# EAGLE design iGeigie-special (EAGLE 5.11)
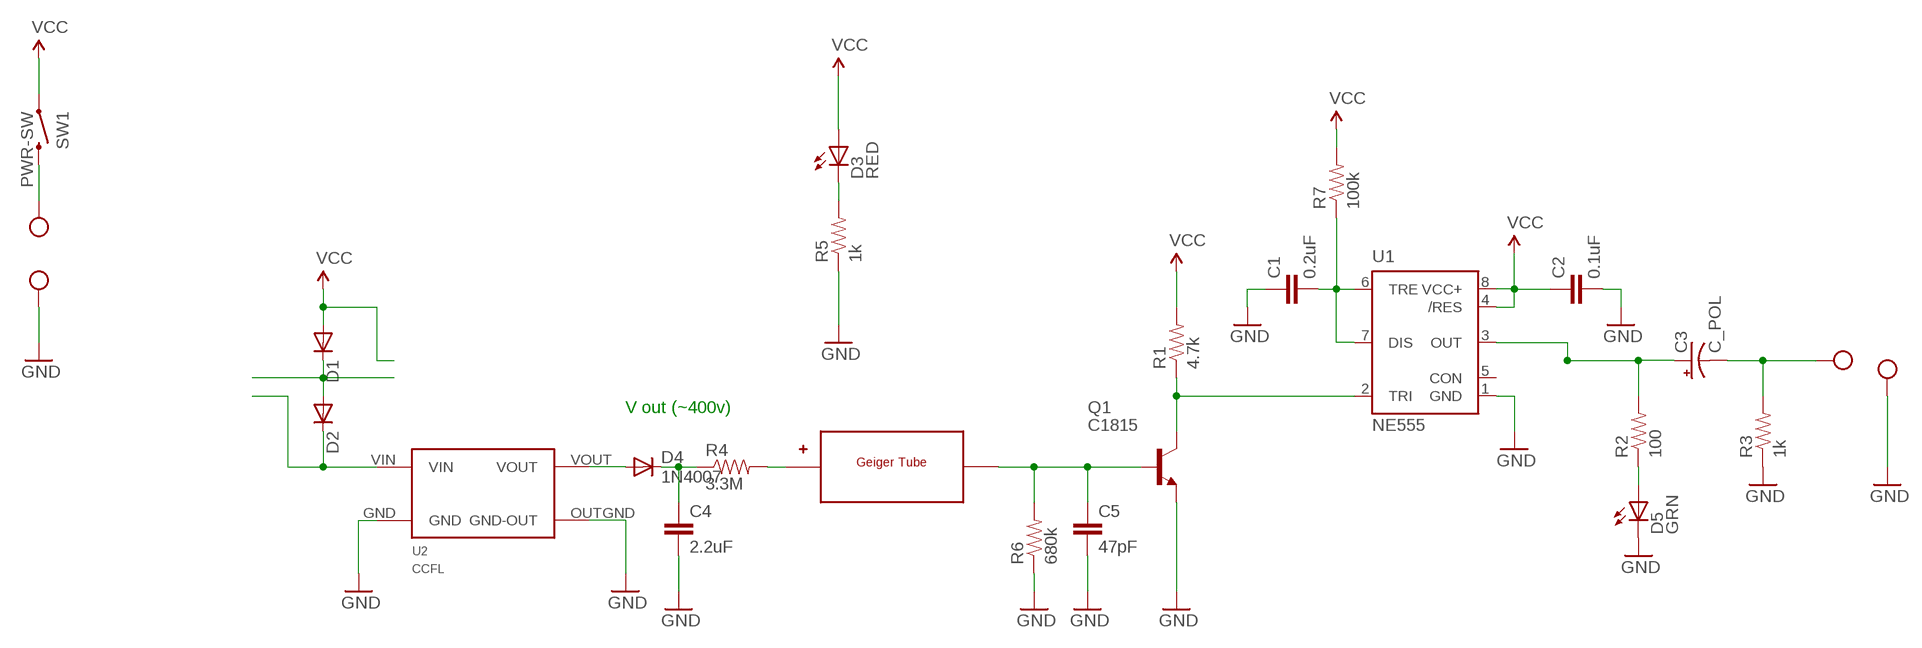
[diagram p0: schematic, sheet 1]

## Parts
C1  0.2uF  C  [C050-025X075]
C2  0.1uF  C  [C050-025X075]
C3  C_POL  [CPOL-RADIAL-100UF-25V]
C4  2.2uF  C-MICA  [C075-063X106]
C5  47pF  C  [C050-025X075]
D1  1N4004  [DO41-10]
D2  1N4004  [DO41-10]
D3  RED  LED  [LED3MM]
D4  1N4007  1N4004  [DO41-10]
D5  GRN  LED  [LED3MM]
Q1  C1815  [TO92]
R1  4.7k  R  [AXIAL-0.3]
R2  100  R  [AXIAL-0.3]
R3  1k  R  [AXIAL-0.3]
R4  3.3M  RBIG  [AXIAL-0.42]
R5  1k  R  [AXIAL-0.3]
R6  680k  R  [AXIAL-0.3]
R7  100k  R  [AXIAL-0.3]
SW1  PWR-SW  [PWR_SWITCH]
U1  NE555  [DIL-08]
U2  CCFL  [CCFL]
U$1  PIN  [PIN]
U$2  PIN  [PIN]
U$3  PIN  [PIN]
U$4  PIN  [PIN]
U$5  GEIGER  [GEIGER]

## Nets
GND: C1.1 C2.2 C4.2 C5.2 D5.K(C) Q1.3(E) R3.P$1 R5.P$1 R6.P$1 U1.1(GND) U2.GND U2.OUTGND(GND-OUT) U$2.P$1 U$3.P$1
N$1: C4.1 D4.C R4.P$1
N$2: R4.P$2 U$5.+
N$3: D3.K(C) R5.P$2
N$4: D1.C D2.A
N$5: C5.1 Q1.2(B) R6.P$2 U$5.-
N$6: Q1.1(C) R1.P$1 U1.2(TRI)
N$7: C3.+ R2.P$2 U1.3(OUT)
N$8: D5.A R2.P$1
N$9: C3.- R3.P$2 U$1.P$1
N$10: D2.C U2.VIN
N$11: D4.A U2.VOUT
N$12: SW1.2 U$4.P$1
N$13: C1.2 R7.P$1 U1.6(TRE) U1.7(DIS)
VCC: C2.1 D1.A D3.A R1.P$2 R7.P$2 SW1.1 U1.4(/RES) U1.8(VCC+)
Unconnected: U1.5(CON)

## Notes on the sheet
- V out (~400v)

## Library data of the parts
C1 C2 C5 = iGeigie:C
C3 = iGeigie:C_POL
C4 = iGeigie:C-MICA
D1 D2 D4 = iGeigie:1N4004: DIODE general purpose rectifier, 1 A
D3 D5 = iGeigie:LED
Q1 = iGeigie:C1815: NPN Transistor
R1-R7 = iGeigie:R
SW1 = iGeigie:PWR-SW
U1 = iGeigie:NE555: General purpose bipolar Timer
U2 = iGeigie:CCFL
U$1-U$4 = iGeigie:PIN
U$5 = iGeigie:GEIGER

## Board
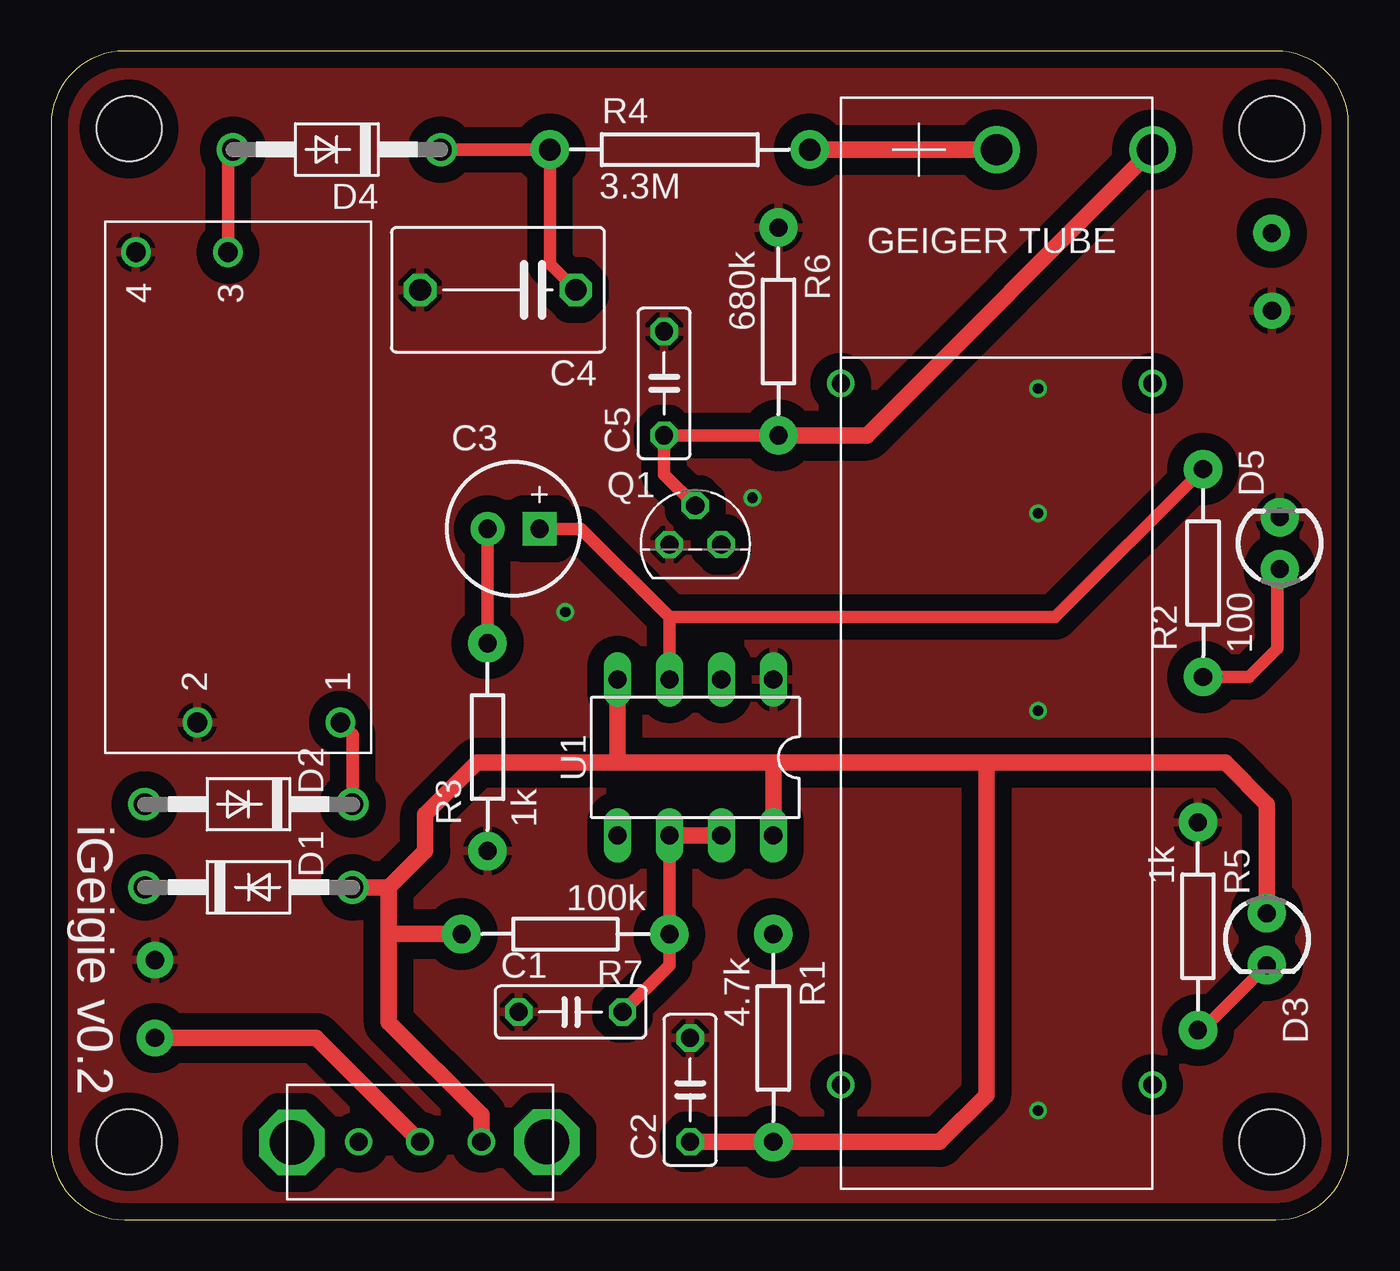
[diagram p1: board, top side]
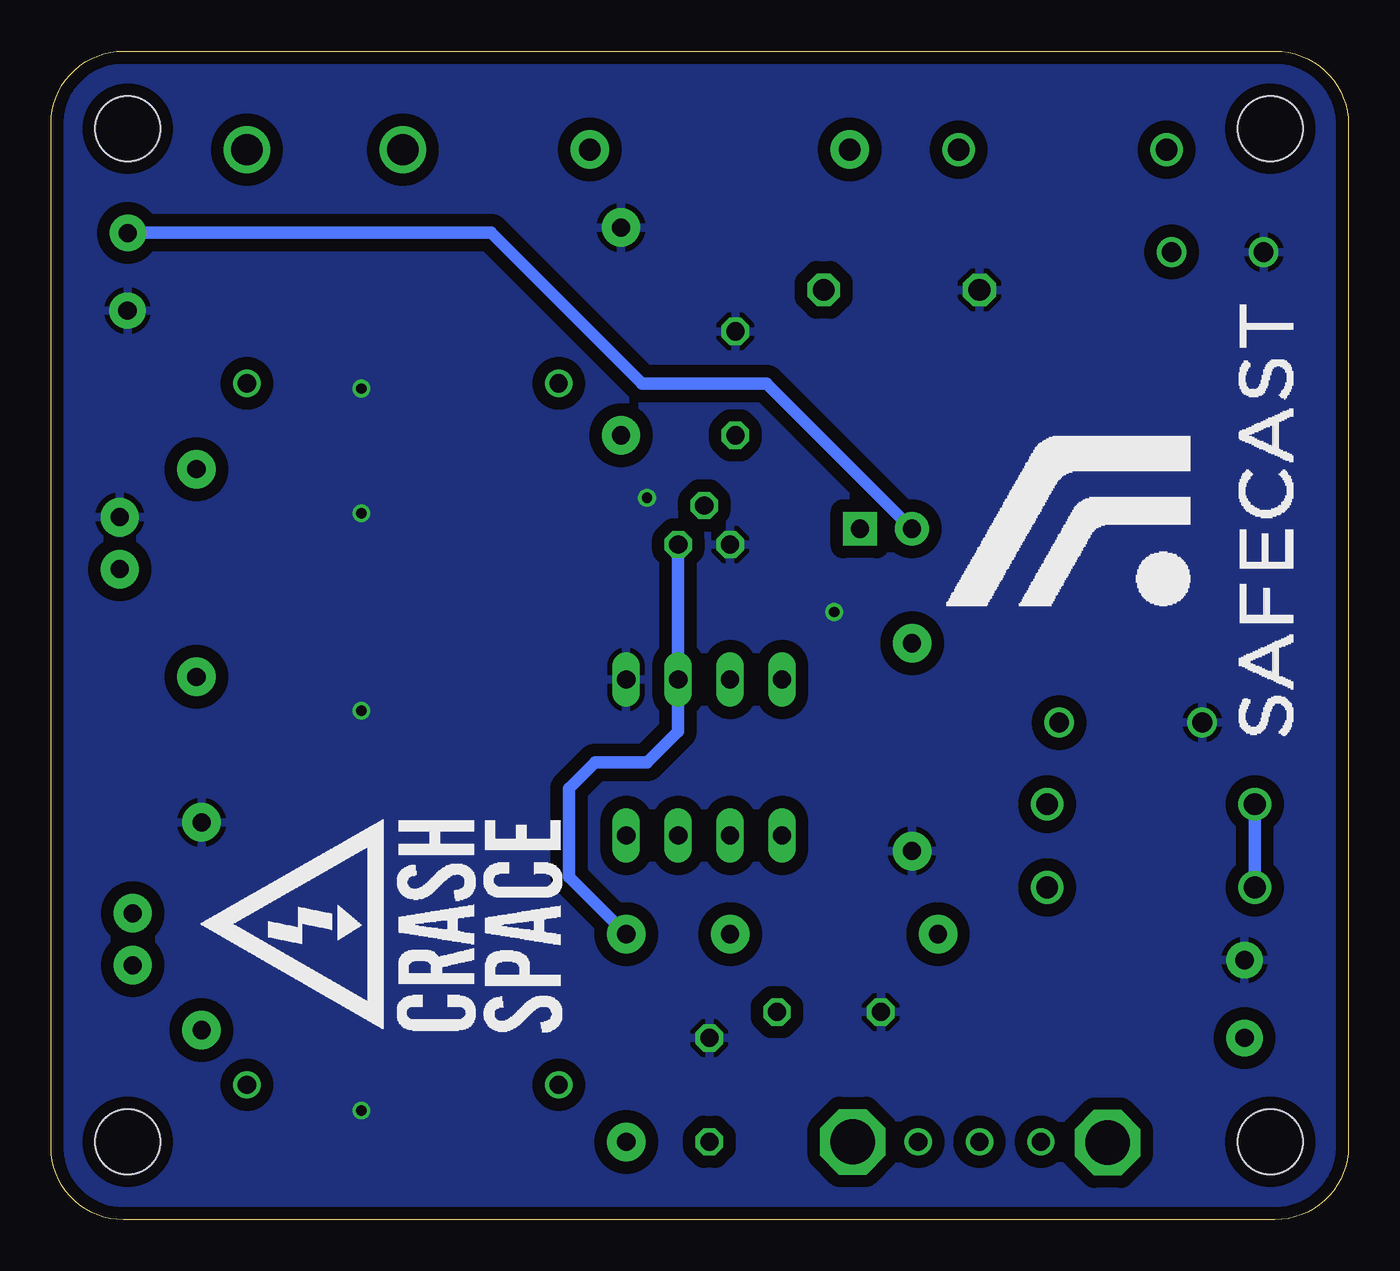
[diagram p2: board, bottom side, seen from below]

Size 63.42 x 57.14 mm. Coordinates in mm from the lower left corner, seen from the top.
Outline: 0,3.59 arc90 3.59,0 59.88,0 arc90 63.42,3.54 63.42,53.61 arc90 59.89,57.14 3.58,57.14 arc90 0,53.55 0,3.59
Copper layers (1*16): Top 0.0356mm / dielectric 1.5011mm / Bottom 0.0356mm
Design rules "LaenPCBOrder": minimum track width 6mil, minimum drill 13mil, track to track 6mil, track to pad 6mil, pad to pad 6mil, via to via 6mil, smd to smd 6mil, copper to edge 15mil, drill to drill 6mil, minimum pad ring 7mil, minimum via ring 7mil, stop-mask expansion 4mil, vias tented up to drill 0mil, thermal gap 10mil
Holes 3.17 mm at 3.81,3.81 59.69,3.81 59.69,53.34 3.81,53.34

### Footprints (pad centres in the part's own frame; a part is rotated, then mirrored left to right if it is on the bottom)
C050-025X075 = drill 0.889 octagon: 1 -2.54,0; 2 2.54,0
CPOL-RADIAL-100UF-25V = drill 0.889 pad 1.651 square: + 1.27,0 | drill 0.889 pad 1.651 round: - -1.27,0
C075-063X106 = drill 1.067 octagon: 1 -3.81,0; 2 3.81,0
DO41-10 = drill 1.067 round: A 5.08,0; C -5.08,0
LED3MM = drill 0.889 pad 1.88 round: A -1.27,0; K 1.27,0
TO92 = drill 0.889 octagon: 1 1.27,0; 2 0,1.905; 3 -1.27,0
AXIAL-0.3 = drill 0.889 pad 1.88 round: P$1 -5.08,0; P$2 5.08,0
AXIAL-0.42 = drill 1.067 pad 1.88 round: P$1 -6.35,0; P$2 6.35,0
PWR_SWITCH = drill 0.889 round: 1 -3,0; 2 0,0; 3 3,0 | drill 2.184 octagon: NC1 -6.2,0; NC2 6.26,0.04
DIL-08 = drill 0.889 long: 1 -3.81,-3.81; 2 -1.27,-3.81; 3 1.27,-3.81; 4 3.81,-3.81; 5 3.81,3.81; 6 1.27,3.81; 7 -1.27,3.81; 8 -3.81,3.81
CCFL = drill 0.965 round: GND -11.5,2; OUTGND 11.5,5; VIN -11.5,-5; VOUT 11.5,0.5
PIN = drill 0.889 pad 1.778 round: P$1 0,0
GEIGER = drill 1.524 round: + 0,0; - 7.62,0 | drill 0.889 round: P$1 -7.62,-11.43; P$2 7.62,-11.43; P$3 7.62,-45.72; P$4 -7.62,-45.72

### Placement (x,y rotation side)
C1  25.4,10.16 0 top
C2  31.24,6.35 90 top
C3  22.61,33.78 0 top
C4  21.84,45.47 180 top
C5  29.97,40.89 90 top
D1  9.65,16.26 0 top
D2  9.65,20.32 180 top
D3  59.44,13.72 270 top
D4  13.97,52.32 180 top
D5  60.07,33.08 90 top
Q1  31.5,33.02 0 top
R1  35.31,8.89 270 top
R2  56.32,31.62 90 top
R3  21.34,23.11 90 top
R4  30.73,52.32 0 top
R5  56.07,14.35 270 top
R6  35.56,43.43 270 top
R7  25.15,13.97 180 top
SW1  18.03,3.81 180 top
U1  31.5,22.61 180 top
U2  9.14,35.81 90 top
U$1  59.68,48.25 0 top
U$2  59.69,44.45 0 top
U$3  5.08,12.7 0 top
U$4  5.08,8.89 0 top
U$5  46.23,52.32 0 top

### Tracks (layer width: path | path; a pad name or v marks a point on that pad's centre or on a via)
GND  (via drill 0.51)
  other vias: 48.26,40.64 48.26,34.54 48.26,24.89 25.15,29.72 48.26,5.33 34.29,35.31
  pour Bottom (isolate 0.61): -0.51,58.17 101.6,58.17 101.6,-1.52 -0.51,-1.52
  pour Top (isolate 0.813): -1.02,0.25 -1.02,57.4 72.39,57.4 72.39,-7.62 -1.02,-7.62
N$1
  Top 0.61: D4.C R4.P$1 24.38,46.74 C4.1
N$2
  Top 0.813: R4.P$2 U$5.+
N$3
  Top 0.61: R5.P$2 56.26,9.27 D3.K
N$4
  Bottom 0.61: D1.C D2.A
N$5
  Top 0.61: R6.P$2 C5.1 29.97,36.45 Q1.2
  Top 0.813: R6.P$2 39.88,38.35 U$5.-
N$6
  Bottom 0.61: Q1.1 U1.2 32.77,23.88 34.29,22.35 36.83,22.35 38.1,21.08 38.1,16.76 R1.P$1
N$7
  Top 0.61: U1.3 30.23,29.46 | 30.23,29.46 25.91,33.78 C3.+ | 30.23,29.46 49.09,29.46 R2.P$2
N$8
  Top 0.61: R2.P$1 58.55,26.54 59.94,27.94 59.94,31.69 D5.A
N$9
  Top 0.61: R3.P$2 C3.-
  Bottom 0.61: C3.- 28.45,40.89 34.54,40.89 41.91,48.26 59.66,48.26 U$1.P$1
N$10
  Top 0.61: D2.C 14.73,23.73 U2.VIN
N$11
  Top 0.61: D4.A 8.64,52.32 U2.VOUT
N$12
  Top 0.813: U$4.P$1 12.95,8.89 SW1.2
N$13
  Top 0.61: C1.2 30.23,12.45 R7.P$1 U1.6
  Top 0.813: U1.6 U1.7
VCC
  Top 0.813: 16.51,16.26 D1.A | 16.51,16.26 18.29,18.03 18.29,19.81 20.83,22.35 27.43,22.35 | U1.4 27.69,22.61 27.43,22.35 | SW1.1 21.03,5.13 16.51,9.65 16.51,13.97 | 16.51,13.97 16.51,16.26 | 16.51,13.97 R7.P$2 | 27.43,22.35 35.56,22.35 | 35.56,22.35 45.72,22.35 | 45.72,22.35 57.4,22.35 59.44,20.32 D3.A | 45.72,22.35 45.72,6.1 43.43,3.81 R1.P$2 C2.1 | U1.8 35.31,22.1 35.56,22.35

### Text on the board
tPlace: iGeigie v0.2